# Altium schematic sheet cpu.SchDoc
size A4
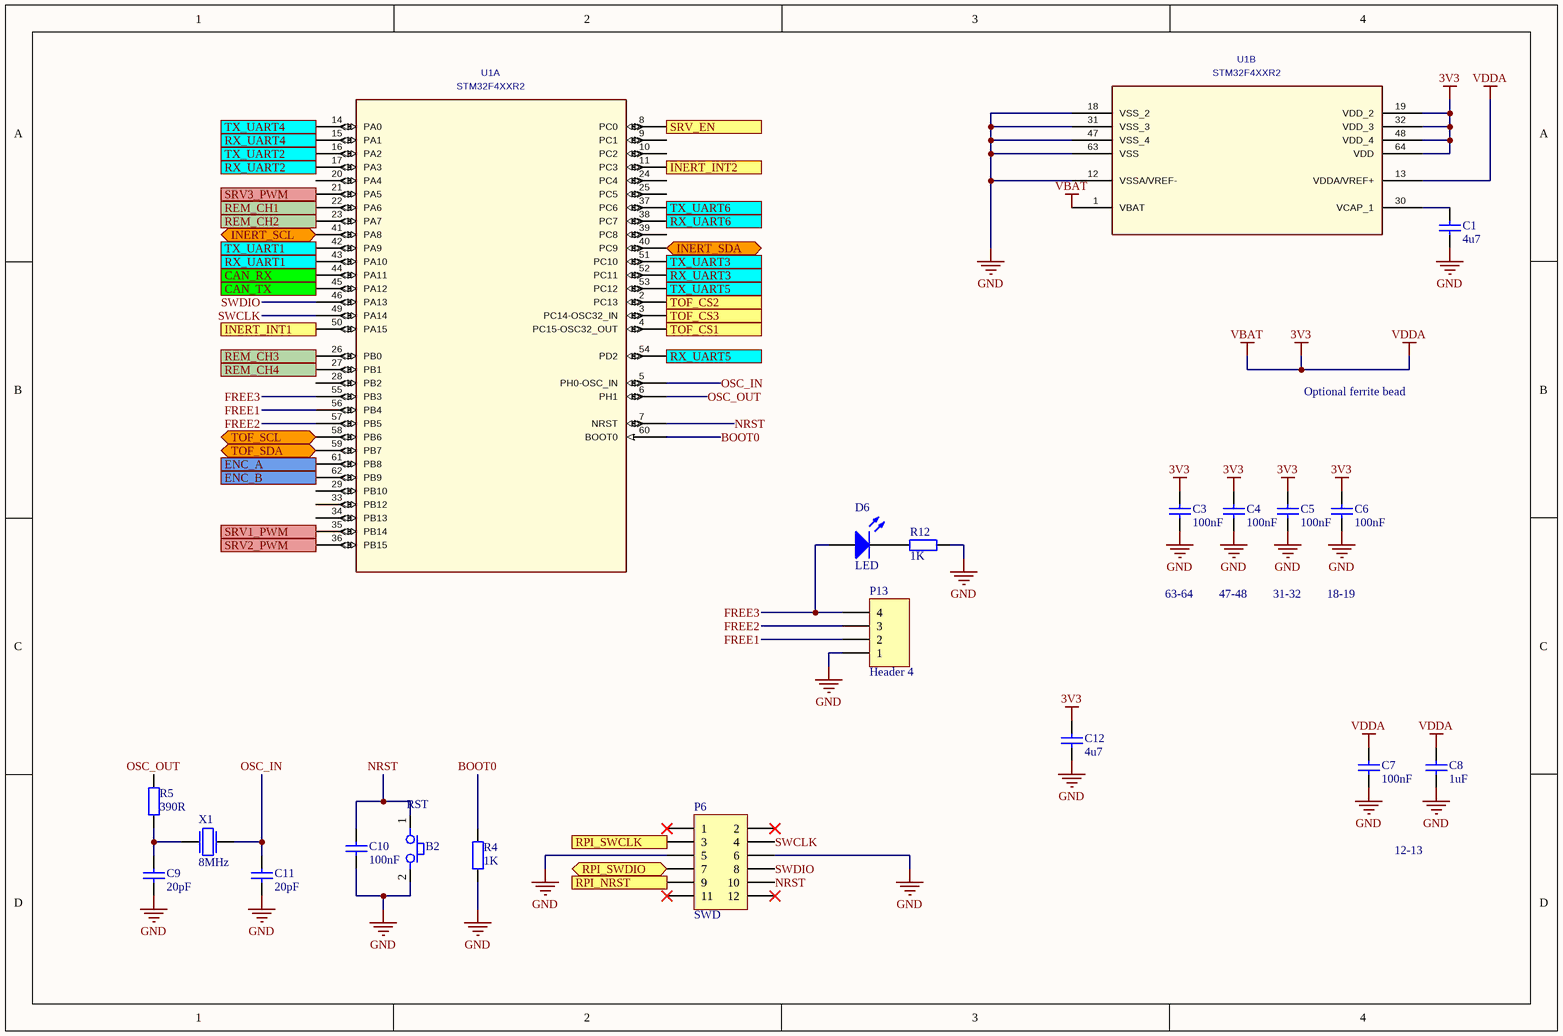
[diagram p0: cpu.SchDoc]

## Parts
B2  RST  [FP_BTN_SMD_3x6]
C1  4u7  [FP_0805_CAP_085]
C3  100nF  [FP_0805_CAP_085]
C4  100nF  [FP_0805_CAP_085]
C5  100nF  [FP_0805_CAP_085]
C6  100nF  [FP_0805_CAP_085]
C7  100nF  [FP_0805_CAP_085]
C8  1uF  [FP_0805_CAP_085]
C9  20pF  [FP_0805_CAP_085]
C10  100nF  [FP_0805_CAP_085]
C11  20pF  [FP_0805_CAP_085]
C12  4u7  [FP_0805_CAP_085]
D6  LED  [FP_0805_LED_RED]
P6  SWD  [HEADER-2X6]
P13  Header 4  [HDR1X4]
R4  1K  [FP_0805_RES]
R5  390R  [FP_0805_RES]
R12  1K  [FP_0805_RES]
U1  STM32F4XXR2  [LQFP64-10X10MM]  (parts A,B of 2)
X1  8MHz  [FP_CRYSTAL_HC49]

## Ports
CAN_RX (in), CAN_TX (out), ENC_A (in), ENC_B (in), INERT_INT1 (in), INERT_INT2 (in), INERT_SCL (bidir), INERT_SDA (bidir), REM_CH1 (in), REM_CH2 (in), REM_CH3 (in), REM_CH4 (in), RPI_NRST (in), RPI_SWCLK (in), RPI_SWDIO (bidir), RX_UART1 (in), RX_UART2 (in), RX_UART3 (in), RX_UART4 (in), RX_UART5 (in), RX_UART6 (in), SRV1_PWM (out), SRV2_PWM (out), SRV3_PWM (out), SRV_EN (out), TOF_CS1 (out), TOF_CS2 (out), TOF_CS3 (out), TOF_SCL (bidir), TOF_SDA (bidir), TX_UART1 (out), TX_UART2 (out), TX_UART3 (out), TX_UART4 (out), TX_UART5 (out), TX_UART6 (out)

## Nets
3V3: C3.2 C4.2 C5.2 C6.2 C7.2 C8.2 C12.2 U1.1(VBAT) U1.13(VDDA/VREF+) U1.19(VDD_2) U1.32(VDD_3) U1.48(VDD_4) U1.64(VDD)  [also labelled VBAT, VDDA]
GND: B2.2 C1.1 C3.1 C4.1 C5.1 C6.1 C7.1 C8.1 C9.1 C10.1 C11.1 C12.1 P6.5 P6.6 P13.1 R4.1 R12.2 U1.12(VSSA/VREF-) U1.18(VSS_2) U1.31(VSS_3) U1.47(VSS_4) U1.63(VSS)
BOOT0: R4.2 U1.60(BOOT0)
CAN_RX: U1.44(PA11) ; port CAN_RX
CAN_TX: U1.45(PA12) ; port CAN_TX
ENC_A: U1.61(PB8) ; port ENC_A
ENC_B: U1.62(PB9) ; port ENC_B
FREE1: P13.2 U1.56(PB4)
FREE2: P13.3 U1.57(PB5)
FREE3: D6.1(A) P13.4 U1.55(PB3)
INERT_INT1: U1.50(PA15) ; port INERT_INT1
INERT_INT2: U1.11(PC3) ; port INERT_INT2
INERT_SCL: U1.41(PA8) ; port INERT_SCL
INERT_SDA: U1.40(PC9) ; port INERT_SDA
NRST: B2.1 C10.2 P6.10 U1.7(NRST)
OSC_IN: C11.2 U1.5(PH0-OSC_IN) X1.2
OSC_OUT: R5.2 U1.6(PH1)
REM_CH1: U1.22(PA6) ; port REM_CH1
REM_CH2: U1.23(PA7) ; port REM_CH2
REM_CH3: U1.26(PB0) ; port REM_CH3
REM_CH4: U1.27(PB1) ; port REM_CH4
RPI_NRST: P6.9 ; port RPI_NRST
RPI_SWCLK: P6.3 ; port RPI_SWCLK
RPI_SWDIO: P6.7 ; port RPI_SWDIO
RX_UART1: U1.43(PA10) ; port RX_UART1
RX_UART2: U1.17(PA3) ; port RX_UART2
RX_UART3: U1.52(PC11) ; port RX_UART3
RX_UART4: U1.15(PA1) ; port RX_UART4
RX_UART5: U1.54(PD2) ; port RX_UART5
RX_UART6: U1.38(PC7) ; port RX_UART6
SRV1_PWM: U1.35(PB14) ; port SRV1_PWM
SRV2_PWM: U1.36(PB15) ; port SRV2_PWM
SRV3_PWM: U1.21(PA5) ; port SRV3_PWM
SRV_EN: U1.8(PC0) ; port SRV_EN
SWCLK: P6.4 U1.49(PA14)
SWDIO: P6.8 U1.46(PA13)
TOF_CS1: U1.4(PC15-OSC32_OUT) ; port TOF_CS1
TOF_CS2: U1.2(PC13) ; port TOF_CS2
TOF_CS3: U1.3(PC14-OSC32_IN) ; port TOF_CS3
TOF_SCL: U1.58(PB6) ; port TOF_SCL
TOF_SDA: U1.59(PB7) ; port TOF_SDA
TX_UART1: U1.42(PA9) ; port TX_UART1
TX_UART2: U1.16(PA2) ; port TX_UART2
TX_UART3: U1.51(PC10) ; port TX_UART3
TX_UART4: U1.14(PA0) ; port TX_UART4
TX_UART5: U1.53(PC12) ; port TX_UART5
TX_UART6: U1.37(PC6) ; port TX_UART6
NetC1_2: C1.2 U1.30(VCAP_1)
NetC9_2: C9.2 R5.1 X1.1
NetD6_2: D6.2(K) R12.1

Not connected (* = marked no-connect by the designer): P6 1* 2* 11* 12*; U1 9(PC1) 10(PC2) 20(PA4) 24(PC4) 25(PC5) 28(PB2) 29(PB10) 33(PB12) 34(PB13) 39(PC8)

## Notes on the sheet
- Optional ferrite bead
- 63-64
- 47-48
- 31-32
- 18-19
- 12-13

## Library data of the parts
B2 = Button 2P: Push button
C1 C3-C12 = CAP: Capacitor
  C1 C12: Value: 4u7
  C3-C7 C10: Value: 100nF
  C8: Value: 1uF
  C9 C11: Value: 20pF
D6 = LED: Typical RED GaAs LED; pin to pad: 1>A 2>K
P6 = Header 6X2: Header, 6-Pin, Dual row; LatestRevisionDate: 17-Jul-2002; LatestRevisionNote: Re-released for DXP Platform.; Publisher: Altium Limited
P13 = Header 4: Header, 4-Pin; LatestRevisionDate: 17-Jul-2002; LatestRevisionNote: Re-released for DXP Platform.; Publisher: Altium Limited
R4 R5 R12 = RES: Resistor
  R4 R12: Value: 1K
  R5: Value: 390R
U1 = STM32F4XXR2: C: Copyright (C) 2016 Accelerated Designs. All rights reserved; Vendor: STMicroelectronics; Value: STM32F4XXR2; Manufacturer_Part_Number: STM32F4XXR2; Copyright: Copyright (C) 2016 Accelerated Designs. All rights reserved
X1 = Crystal: Quarz Crystal; Value: 8MHz